# Altium schematic sheet Main.SchDoc
size 203 x 63 mm
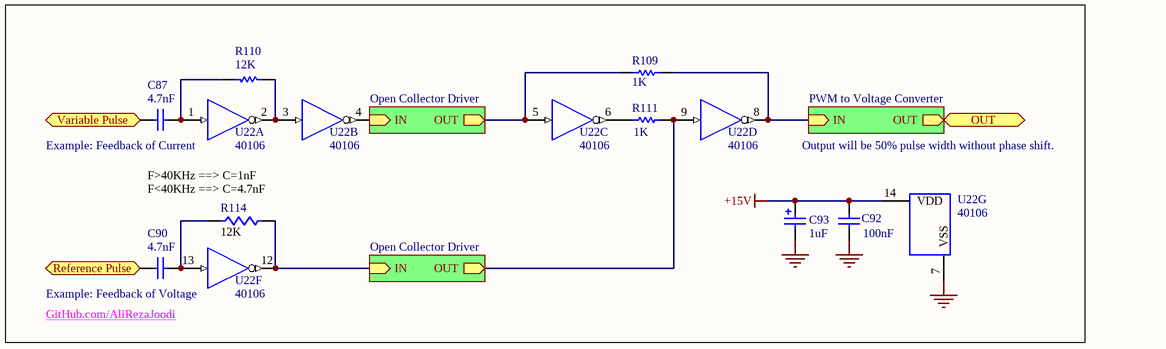
[diagram p0: Main.SchDoc]

## Parts
C87  value 4.7nF  [RESC3216N]  (hidden comment: Cap)
C90  value 4.7nF  [RESC3216N]  (hidden comment: Cap)
C92  value 100nF  [0805]  (hidden comment: Cap)
C93  value 1uF  [Cap_A]  (hidden comment: Cap Pol1)
R109  value 1K  [0805]  (hidden comment: Res1)
R110  value 12K  [0805]  (hidden comment: Res1)
R111  value 1K  [0805]  (hidden comment: Res1)
R114  value 12K  [0805]  (hidden comment: CAP)
U22  40106  [SOP127P636-14N]  (parts A,B,C,D,F,G of 7)

## Sub-sheets
Open Collector Driver = Driver_Open Collector.SchDoc: IN (in), OUT (out)
Open Collector Driver = Driver_Open Collector.SchDoc: IN (in), OUT (out)
PWM to Voltage Converter = Converter_PWM to Voltage.SchDoc: IN (in), OUT (out)

## Ports
OUT (out), Reference Pulse (in), Variable Pulse (in)

## Nets
+15V: C92.1 C93.1 U22.14(VDD)
GND: C92.2 C93.2 U22.7(VSS)
OUT: port OUT, sheet PWM to Voltage Converter/OUT
Reference Pulse: C90.2 ; port Reference Pulse
Variable Pulse: C87.2 ; port Variable Pulse
NetC87_1: C87.1 R110.1 U22.1(I)
NetC90_1: C90.1 R114.1 U22.13(I)
NetR109_1: R109.1 U22.8(~{O}) ; sheet PWM to Voltage Converter/IN
NetR109_2: R109.2 U22.5(I) ; sheet Open Collector Driver/OUT
NetR110_2: R110.2 U22.2(~{O}) U22.3(I)
NetR111_1: R111.1 U22.6(~{O})
NetR111_2: R111.2 U22.9(I) ; sheet Open Collector Driver/OUT
NetR114_2: R114.2 U22.12(~{O}) ; sheet Open Collector Driver/IN
NetU22_4: U22.4(~{O}) ; sheet Open Collector Driver/IN

## Notes on the sheet
- Example: Feedback of Current
- Output will be 50% pulse width without phase shift.
- (near R114) F>40KHz ==> C=1nF
  F<40KHz ==> C=4.7nF
- Example: Feedback of Voltage
- GitHub.com/AliRezaJoodi

## Library data of the parts
C87 C92 = Cap: Capacitor; Published: 8-Jun-2000; LatestRevisionDate: 17-Jul-2002; LatestRevisionNote: Re-released for DXP Platform.; PackageReference: RAD-0.3; Publisher: Altium Limited
C90 = Cap: Capacitor; Manufacturer: Generic Components; Class I: Passive; Published: 8-Jun-2000; Revision: July-2002: Re-released for DXP Platform.; Publisher: Altium Limited; Class II: Capacitor
C93 = Cap Pol1: Polarized Capacitor (Radial); Manufacturer: Generic Components; Class I: Passive; Published: 8-Jun-2000; Revision: July-2002: Re-released for DXP Platform.; Publisher: Altium Limited; Class II: Capacitor
R109-R111 = Res1: Resistor; Published: 8-Jun-2000; LatestRevisionDate: 17-Jul-2002; LatestRevisionNote: Re-released for DXP Platform.; PackageReference: AXIAL-0.3; Publisher: Altium Limited
R114 = Res1: Resistor; Manufacturer: Generic Components; Class I: Passive; Published: 8-Jun-2000; Revision: July-2002: Re-released for DXP Platform.; Publisher: Altium Limited; Class II: Resistor
U22 = 40106: Hex inverting Schmitt trigger, 14-Pin; Publisher: Altium Limited; ComponentLink1URL: http://www.nxp.com